# Altium project SDR_PMR.PrjPcb (part 5 of 12)

## Sheet Headphone_Amplifier.SchDoc
size A4; DocumentNumber: 8; SheetNumber: 12; SheetTotal: 18
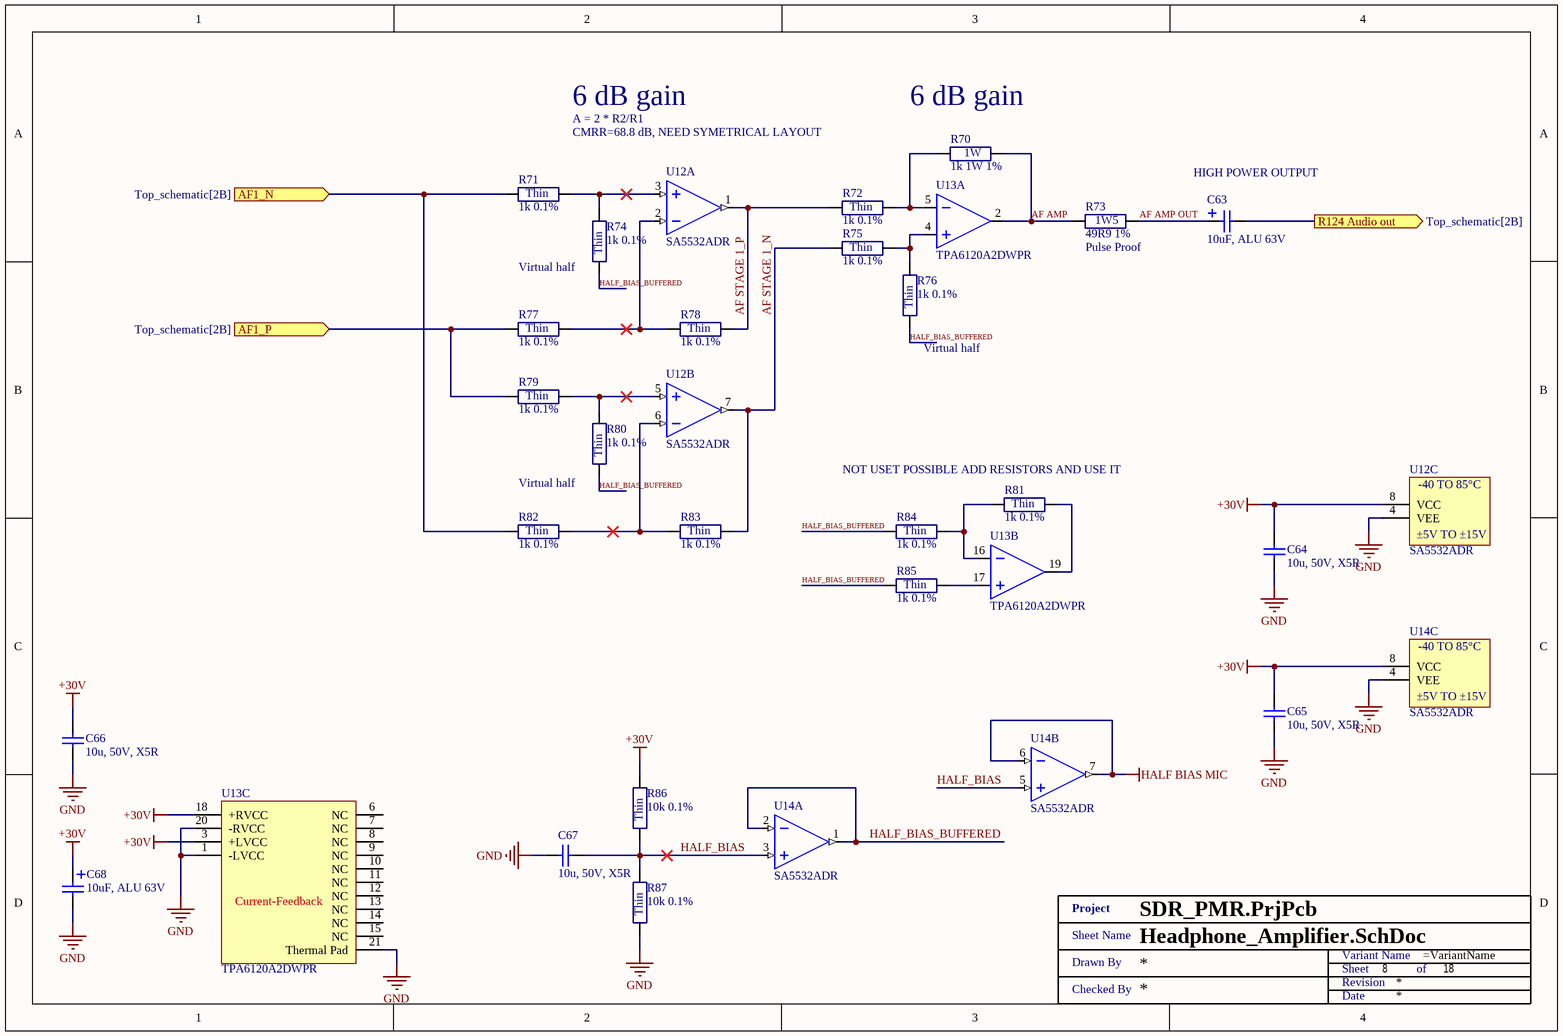
[diagram p4: Headphone_Amplifier.SchDoc]

### Parts
(Parts that share a designator on the sheet are numbered #1, #2 ... from top to bottom, then left to right.)
C63  10uF, ALU 63V  [WCAP-ATLI_5x11x2]
C64  10u, 50V, X5R  [SMD1206]
C65  10u, 50V, X5R  [SMD1206]
C66  10u, 50V, X5R  [SMD1206]
C67  10u, 50V, X5R  [SMD1206]
C68  10uF, ALU 63V  [WCAP-ATLI_5x11x2]
R70  1k 1W 1%  [SMD 2512 Resistor]
R71  1k 0.1%  [SMD0402 - R]
R72  1k 0.1%  [SMD0402 - R]
R73  49R9 1%  Info: Pulse Proof  [SMD 2512 Resistor]
R74  1k 0.1%  [SMD0402 - R]
R75  1k 0.1%  [SMD0402 - R]
R76  1k 0.1%  [SMD0402 - R]
R77  1k 0.1%  [SMD0402 - R]
R78  1k 0.1%  [SMD0402 - R]
R79  1k 0.1%  [SMD0402 - R]
R80  1k 0.1%  [SMD0402 - R]
R81  1k 0.1%  [SMD0402 - R]
R82  1k 0.1%  [SMD0402 - R]
R83  1k 0.1%  [SMD0402 - R]
R84  1k 0.1%  [SMD0402 - R]
R85  1k 0.1%  [SMD0402 - R]
R86  10k 0.1%  [SMD0402 - R]
R87  10k 0.1%  [SMD0402 - R]
U12  SA5532ADR  [SOIC08]  (parts A,B,C of 3)
U13  TPA6120A2DWPR  [SOIC20 - PowerPAD]  (parts A,B,C of 3)
U14  SA5532ADR  [SOIC08]  (parts A,B,C of 3)
XX?#5  Title 1  (value not drawn)  (graphical)

### Ports
AF1_N (in, see Top_schematic[2B]), AF1_P (in, see Top_schematic[2B]), R124 Audio out (out, see Top_schematic[2B])

### Nets
+30V: C64.2 C65.2 C66.2 C68.1 R86.2 U12.8(VCC) U13.3(+LVCC) U13.18(+RVCC) U14.8(VCC)
GND: C64.1 C65.1 C66.1 C67.2 C68.2 R87.1 U12.4(VEE) U13.1(-LVCC) U13.20(-RVCC) U13.21(Thermal_Pad) U14.4(VEE)
HALF BIAS MIC: U14.6(-IN_B) U14.7(OUT_B)
AF AMP: R70.2(GND) R73.1 U13.2(OUT1)
AF AMP OUT: C63.1 R73.2(GND)
AF STAGE 1_N: R75.1 R83.2 U12.7(OUT_B)
AF STAGE 1_P: R72.1 R78.2 U12.1(OUT_A)
HALF_BIAS: C67.1 R86.1 R87.2 U14.3(+IN_A) U14.5(+IN_B)
HALF_BIAS_BUFFERED: R74.1 R76.1 R80.1 R84.1 R85.1 U14.1(OUT_A) U14.2(-IN_A)
NetC63_2: C63.2 ; port R124 Audio out
NetR70_1: R70.1 R72.2 U13.5(IN1-)
NetR71_1: R71.1 R82.1 ; port AF1_N
NetR71_2: R71.2 R74.2 U12.3(+IN_A)
NetR75_2: R75.2 R76.2 U13.4(IN1+)
NetR77_1: R77.1 R79.1 ; port AF1_P
NetR77_2: R77.2 R78.1 U12.2(-IN_A)
NetR79_2: R79.2 R80.2 U12.5(+IN_B)
NetR81_1: R81.1 R84.2 U13.16(IN2-)
NetR81_2: R81.2 U13.19(OUT2)
NetR82_2: R82.2 R83.1 U12.6(-IN_B)
NetR85_2: R85.2 U13.17(IN2+)

Not connected (* = marked no-connect by the designer): U13 6(NC) 7(NC) 8(NC) 9(NC) 10(NC) 11(NC) 12(NC) 13(NC) 14(NC) 15(NC)

### Notes on the sheet
- 6 dB gain
- (near R70) 6 dB gain
- A = 2 * R2/R1
- CMRR=68.8 dB, NEED SYMETRICAL LAYOUT
- (near C63) HIGH POWER OUTPUT
- (near R74) Virtual half
- (near R76) Virtual half
- (near R80) Virtual half
- (near R81) NOT USET POSSIBLE ADD RESISTORS AND USE IT
- (in symbol CRCW251249R9FKEGHP) 1W5
- (in symbol SA5532ADR, part C) -40 TO 85°C; ±5V TO ±15V
- (in symbol TC0225B1001TCC) Thin
- (in symbol TC0225B1002TCC) Thin
- (in symbol Title 1) Project; Sheet Name; Variant Name; Drawn By; Sheet; of; Revision; Checked By; Date
- (in symbol TPA6120A2DWPR, part C) Current-Feedback

### Library data of the parts
C63 C68 = 860080772001: WURTH ELEKTRONIK - 860080772001 - CAP, ALU ELEC, 10UF, 63V, RADIAL; Ripple Current: 135mA @ 100kHz; Capacitance: 10u; Manufacturer: WURTH ELEKTRONIK; Manufacturer Part Number: 860080772001; RoHS: YES; Stock 1: 553; Pricing 1: 1=0.0957, 3=0.091, 5=0.0863, 10=0.0825, 20=0.0786, 50=0.0692, 250=0.0647, 500=0.0564 (GBP); ComponentLink1URL: http://www.farnell.com/datasheets/1879798.pdf; ComponentLink1Description: http://www.farnell.com/datasheets/1879798.pdf; Voltage Rating: 63V; Stock 3: 2136; Pricing 3: 1=0.62, 50=0.335, 100=0.289, 250=0.259, 500=0.235, 1500=0.202, 7500=0.182, 15000=0.178 (GBP); ComponentLink2URL: http://www.farnell.com/datasheets/2065186.pdf; ComponentLink2Description: http://www.farnell.com/datasheets/2065186.pdf; Supplier 1: Mouser; Supplier Part Number 1: 710-860080772001; Supplier 2: Farnell; Supplier Part Number 2: 2465955; Supplier 3: Digi-Key; Supplier Part Number 3: 732-9121-1-ND
C64-C67 = UMK316BBJ106KL-T: CAP CER 10UF 50V X5R 1206; Manufacturer: Taiyo Yuden; Tolerance: 10%; Supplier 1: Mouser; Supplier Part Number 1: 963-UMK316BBJ106KL-T; Manufacturer Part Number: UMK316BBJ106KL-T; RoHS: Yes; Category: Ceramic Capacitors; Stock 1: 207945; Pricing 1: 1=0,42000, 10=0,18000, 100=0,12800, 500=0,11000, 1000=0,09700, 2000=0,08000 (USD); Mount: Surface Mount; Case/Package: 1206; Min Operating Temperature: -55°C; Max Operating Temperature: 85°C; Packaging: Tape and Reel; Capacitance: 10u; Voltage Rating: 50V; Length: 0.126inch; Width: 0.063inch; Thickness: 0.071inch; Lead Free: Lead Free; ComponentLink1URL: http://ds.yuden.co.jp/TYCOMPAS/ut/detail.do?productNo=UMK316BBJ106KL-T&fileName=UMK316BBJ106KL-T_SS&mode=specSheetDownload&src-supplier=Digi-Key; ComponentLink1Description: http://ds.yuden.co.jp/TYCOMPAS/ut/detail.do?productNo=UMK316BBJ106KL-T&fileName=UMK316BBJ106KL-T_SS&mode=specSheetDownload&src-supplier=Digi-Key; ComponentLink2URL: https://www.yuden.co.jp/productdata/catalog/mlcc01_e.pdf?src-supplier=Digi-Key; ComponentLink2Description: https://www.yuden.co.jp/productdata/catalog/mlcc01_e.pdf?src-supplier=Digi-Key; ComponentLink3URL: http://www.yuden.co.jp/productdata/catalog/en/mlcc_all_e.pdf?src-supplier=Digi-Key; ComponentLink3Description: http://www.yuden.co.jp/productdata/catalog/en/mlcc_all_e.pdf?src-supplier=Digi-Key; Supplier 2: Digi-Key; Supplier Part Number 2: 587-5960-1-ND; Supplier 3: Avnet; Supplier Part Number 3: UMK316BBJ106KL-T
R70 = AC2512FK-071KL: Res Thick Film 2512 1K Ohm 1% 1W ±100ppm/C Pad SMD T/R Automotive AEC-Q200; Manufacturer: Yageo Group; Temperature Coefficient: 100ppm/°C; Working Voltage: 200V; Supplier: Mouser; Supplier Part Number: 603-AC2512FK-071KL; Manufacturer Part Number: AC2512FK-071KL; RoHS: Compliant; Category: Chip SMD Resistors; Stock: 1301; Pricing: 1=0,32, 10=0,176, 50=0,154, 100=0,119, 1000=0,093, 10000=0,078 (USD); Case/Package: 2512; Case Code (Imperial): 2512; Case Code (Metric): 6432; China RoHS: Non-Compliant; Composition: Thick Film; Features: Automotive AEC-Q200, Moisture Resistant; Height: 550µm; Length: 6.35mm; Lifecycle Status: Production; Max Operating Temperature: 155°C; Max Power Dissipation: 1W; Min Operating Temperature: -55°C; Mounting Technology: Surface Mount; Number of Terminals: 2; Number of Terminations: 2; Power Rating: 1W; Ratings: AEC-Q200; REACH SVHC: Yes; Resistance: 1k; Schedule B: 8533210045, 8533210045|8533210045|8533210045|8533210045|8533210045; Tolerance: 1%; Width: 3.1mm; ComponentLink1URL: https://datasheet.octopart.com:443/AC2512FK-071KL-Yageo-datasheet-182189377.pdf?src-supplier=IHS; ComponentLink1Description: https://datasheet.octopart.com:443/AC2512FK-071KL-Yageo-datasheet-182189377.pdf?src-supplier=IHS; ComponentLink2URL: https://datasheet.octopart.com:443/AC2512FK-071KL-Yageo-Group-datasheet-188689268.pdf?src-supplier=LCSC; ComponentLink2Description: https://datasheet.octopart.com:443/AC2512FK-071KL-Yageo-Group-datasheet-188689268.pdf?src-supplier=LCSC; ComponentLink3URL: https://datasheet.octopart.com:443/AC2512FK-071KL-Yageo-datasheet-178509465.pdf?src-supplier=Farnell; ComponentLink3Description: https://datasheet.octopart.com:443/AC2512FK-071KL-Yageo-datasheet-178509465.pdf?src-supplier=Farnell; ComponentLink4URL: https://datasheet.octopart.com:443/AC2512FK-071KL-Yageo-datasheet-166720450.pdf?src-supplier=Future+Electronics; ComponentLink4Description: https://datasheet.octopart.com:443/AC2512FK-071KL-Yageo-datasheet-166720450.pdf?src-supplier=Future+Electronics; ComponentLink5URL: https://datasheet.octopart.com:443/AC2512FK-071KL-Yageo-datasheet-151884373.pdf?src-supplier=Future+Electronics; ComponentLink5Description: https://datasheet.octopart.com:443/AC2512FK-071KL-Yageo-datasheet-151884373.pdf?src-supplier=Future+Electronics; ComponentLink6URL: https://datasheet.octopart.com:443/AC2512FK-071KL-Yageo-datasheet-137699919.pdf?src-supplier=Future+Electronics; ComponentLink6Description: https://datasheet.octopart.com:443/AC2512FK-071KL-Yageo-datasheet-137699919.pdf?src-supplier=Future+Electronics; ComponentLink7URL: https://datasheet.octopart.com:443/AC2512FK-071KL-Yageo-datasheet-83209224.pdf?src-supplier=Future+Electronics; ComponentLink7Description: https://datasheet.octopart.com:443/AC2512FK-071KL-Yageo-datasheet-83209224.pdf?src-supplier=Future+Electronics; ComponentLink8URL: https://datasheet.octopart.com:443/AC2512FK-071KL-Yageo-datasheet-62139191.pdf?src-supplier=Future+Electronics; ComponentLink8Description: https://datasheet.octopart.com:443/AC2512FK-071KL-Yageo-datasheet-62139191.pdf?src-supplier=Future+Electronics; ComponentLink9URL: https://datasheet.octopart.com:443/AC2512FK-071KL-Yageo-Group-datasheet-164768995.pdf?src-supplier=ODG+(Origin+Data+Global); ComponentLink9Description: https://datasheet.octopart.com:443/AC2512FK-071KL-Yageo-Group-datasheet-164768995.pdf?src-supplier=ODG+(Origin+Data+Global); ComponentLink10URL: https://datasheet.octopart.com/AC2512FK-071KL-Yageo-datasheet-12512238.pdf; ComponentLink10Description: https://datasheet.octopart.com/AC2512FK-071KL-Yageo-datasheet-12512238.pdf; ComponentLink11URL: http://sigma.octopart.com:80/conflict_mineral_statement/Yageo-company-3.pdf?src-supplier=Compliance+Statements; ComponentLink11Description: http://sigma.octopart.com:80/conflict_mineral_statement/Yageo-company-3.pdf?src-supplier=Compliance+Statements; ComponentLink12URL: http://sigma.octopart.com:80/rohs_statement/Yageo-company-2.pdf?src-supplier=Compliance+Statements; ComponentLink12Description: http://sigma.octopart.com:80/rohs_statement/Yageo-company-2.pdf?src-supplier=Compliance+Statements
R71 R72 R74-R85 = TC0225B1001TCC: 62.5mW Thin Film Resistor 25V ±25ppm/℃ ±0.1% 1kΩ 0402 Chip Resistor - Surface Mount ROHS; Manufacturer: Uniroyal; Working Voltage: 50V; Supplier 1: LCSC; Supplier Part Number 1: C2989674; Manufacturer Part Number: TC0225B1001TCC; Category: Chip SMD Resistors; Stock 1: 12060; Pricing 1: 20=0.036, 200=0.031, 600=0.0283, 2000=0.0267, 10000=0.0252, 20000=0.0245 (USD); Case/Package: 0402; Composition: Thin Film; Export Control Classification Number (ECCN) Code: EAR99; Height: 300µm; Harmonized Tariff Schedule (HTS) Code: 8533.21.00.30; Length: 1mm; Lifecycle Status: Production; Max Operating Temperature: 155°C; Min Operating Temperature: -55°C; Mounting Technology: Surface Mount; Number of Terminals: 2; Power Rating: 62.5mW; Resistance: 1k; Tolerance: 0.1%; Width: 500µm; ComponentLink1URL: https://datasheet.octopart.com:443/TC0225B1001TCC-Uniroyal-datasheet-194228365.pdf?src-supplier=LCSC; ComponentLink1Description: https://datasheet.octopart.com:443/TC0225B1001TCC-Uniroyal-datasheet-194228365.pdf?src-supplier=LCSC
R73 = CRCW251249R9FKEGHP: Res Thick Film 2512 49.9 Ohm 1% 1.5W ±100ppm/°C Molded SMD SMD Blister T/R; Manufacturer: Vishay Dale; Voltage Rating: 500V; Supplier 1: Mouser; Supplier Part Number 1: 71-CRCW251249R9FKEGH; Manufacturer Part Number: CRCW251249R9FKEGHP; RoHS: Yes; Category: Chip SMD Resistors; Stock 1: 291; Pricing 1: 1=0.73, 10=0.46, 50=0.46, 100=0.338, 1000=0.203, 10000=0.182 (USD); Case/Package: 2512; Weight: 0.001482oz; Case Code (Metric): 6432; Case Code (Imperial): 2512; Contact Plating: Tin; Min Operating Temperature: -55°C; Max Operating Temperature: 155°C; Packaging: Tape and Reel; Resistance: 49R9; Tolerance: 1%; Power Rating: 1.5W; Package Quantity: 2000; Number of Terminations: 2; Max Power Dissipation: 1.5W; Temperature Coefficient: 100ppm/°C; Features: Automotive AEC-Q200; Series: CRCW-HP; Length: 6.3mm; Width: 3.2mm; Height: 0.6mm; Ratings: AEC-Q200; Radiation Hardening: No; Lead Free: Lead Free; RoHS Compliant: Yes; ComponentLink1URL: https://datasheet.ciiva.com/2483/crcwhpe3-2483893.pdf?src-supplier=Digi-Key; ComponentLink1Description: https://datasheet.ciiva.com/2483/crcwhpe3-2483893.pdf?src-supplier=Digi-Key; ComponentLink2URL: https://datasheet.ciiva.com/2483/crcwhpe3-2483894.pdf?src-supplier=Digi-Key; ComponentLink2Description: https://datasheet.ciiva.com/2483/crcwhpe3-2483894.pdf?src-supplier=Digi-Key; ComponentLink3URL: https://datasheet.ciiva.com/2483/crcwhpe3-2483895.pdf?src-supplier=Digi-Key; ComponentLink3Description: https://datasheet.ciiva.com/2483/crcwhpe3-2483895.pdf?src-supplier=Digi-Key; ComponentLink4URL: https://datasheet.ciiva.com/5548/crcwhpe3-46056-5548183.pdf?src-supplier=Mouser; ComponentLink4Description: https://datasheet.ciiva.com/5548/crcwhpe3-46056-5548183.pdf?src-supplier=Mouser; Supplier 2: Digi-Key; Supplier Part Number 2: 541-49.9RCT-ND; Supplier 3: Arrow Electronics; Supplier Part Number 3: CRCW251249R9FKEGHP
R86 R87 = TC0225B1002TCC: Fixed Resistor, Thin Film, 0.0625W, 10000ohm, 50V, 0.1% +/-Tol, Surface Mount, 0402; Manufacturer: Uniroyal; Power Rating: 62.5mW; Supplier 1: LCSC; Supplier Part Number 1: C2989267; Manufacturer Part Number: TC0225B1002TCC; Category: Chip SMD Resistors; Stock 1: 10200; Pricing 1: 20=0.0396, 200=0.0352, 600=0.0327, 2000=0.0312, 10000=0.0299, 20000=0.0292 (USD); Case/Package: 0402; Composition: Thin Film; Export Control Classification Number (ECCN) Code: EAR99; Height: 300µm; Harmonized Tariff Schedule (HTS) Code: 8533.21.00.30; Length: 1mm; Lifecycle Status: Production; Max Operating Temperature: 155°C; Min Operating Temperature: -55°C; Mounting Technology: Surface Mount; Number of Terminals: 2; Resistance: 10k; Tolerance: 0.1%; Width: 500µm; Working Voltage: 50V; ComponentLink1URL: https://datasheet.octopart.com:443/TC0225B1002TCC-Uniroyal-datasheet-194228365.pdf?src-supplier=LCSC; ComponentLink1Description: https://datasheet.octopart.com:443/TC0225B1002TCC-Uniroyal-datasheet-194228365.pdf?src-supplier=LCSC
U12 U14 = SA5532ADR: ROHS3Compliant EAR99 SA5532 Cut Tape (CT) op amp buffer circuit 4.9mm 200nA 4mV 10000kHz; Manufacturer: Texas Instruments; Manufacturer Lifecycle Status: ACTIVE; Bandwidth: 10MHz; Common Mode Rejection Ratio: 70dB; Input Bias Current: 800nA; Max Dual Supply Voltage: 15V; Min Dual Supply Voltage: 5V; Nominal Supply Current: 16mA; Number of Channels: 2; Operating Supply Current: 8mA; Output Current: 38mA; Slew Rate: 9V/µs; Voltage Gain: 100dB; Manufacturer Part Number: SA5532ADR; RoHS: Compliant; Category: Amplifiers - Op Amps, Buffer, Instrumentation; Pricing 1: 1=0.58, 10=0.405, 50=0.363, 100=0.316, 1000=0.269, 10000=0.249 (USD); Case/Package: SOIC; Contact Plating: Gold; Gain Bandwidth Product: 10MHz; Height: 1.75mm; Input Offset Voltage (Vos): 4mV; Lead Free: Lead Free; Length: 4.9mm; Lifecycle Status: Production; Max I/O Voltage: 4mV; Max Operating Temperature: 85°C; Max Supply Voltage: 15V; Min Operating Temperature: -40°C; Nominal Gain Bandwidth Product: 10MHz; Number of Circuits: 2; Number of Elements: 2; Pins: 8; Output Current per Channel: 38mA; Radiation Hardening: No; Schedule B: 8542330000, 8542330000|8542330000|8542330000|8542330000|8542330000; Thickness: 1.58mm; Width: 3.91mm; ComponentLink1URL: https://datasheet.octopart.com:443/SA5532ADR-Texas-Instruments-datasheet-41216652.pdf?src-supplier=Texas+Instruments; ComponentLink1Description: https://datasheet.octopart.com:443/SA5532ADR-Texas-Instruments-datasheet-41216652.pdf?src-supplier=Texas+Instruments; ComponentLink2URL: https://octopart.com:443/opatz8j6/c1?t=BMvzKz7-sj-S1-Dsr8DdYqdwvlAJ1p8EkRXKuSmmWP-6byp-ij1qjOCBNe3kiZ3VXcZV_2y_9BNtRyS6u4HeRxplgPa6tIscd6ONAd2o7cOSCVgEvHKbcW5aVa9TzAtJzxrLl3EL3jMW4_3-9hBLoKePFC9U6uwTHoowvK-6ULYqA_cqsAnRVsDlRoqy1hQQmhpGhdTdZRO1RoDh0uRfck1XzJnG1HhE6rhdpTgDPcT597XV8iSYx_kN_H9eCK8qNRRFOX_BOxK1gYE8mPq_MY-XmnDjgshG-IxPARb-O9C2qjigCjmd4F8ZlZv55EvB5eotoi6nSKHqH6N_VFx0jIAU0z77gYIUEADzPI9nLSljJ6AxAnNjNOtkzVrGTAn7ZMs&src-supplier=Texas+Instruments; ComponentLink2Description: https://octopart.com:443/opatz8j6/c1?t=BMvzKz7-sj-S1-Dsr8DdYqdwvlAJ1p8EkRXKuSmmWP-6byp-ij1qjOCBNe3kiZ3VXcZV_2y_9BNtRyS6u4HeRxplgPa6tIscd6ONAd2o7cOSCVgEvHKbcW5aVa9TzAtJzxrLl3EL3jMW4_3-9hBLoKePFC9U6uwTHoowvK-6ULYqA_cqsAnRVsDlRoqy1hQQmhpGhdTdZRO1RoDh0uRfck1XzJnG1HhE6rhdpTgDPcT597XV8iSYx_kN_H9eCK8qNRRFOX_BOxK1gYE8mPq_MY-XmnDjgshG-IxPARb-O9C2qjigCjmd4F8ZlZv55EvB5eotoi6nSKHqH6N_VFx0jIAU0z77gYIUEADzPI9nLSljJ6AxAnNjNOtkzVrGTAn7ZMs&src-supplier=Texas+Instruments; ComponentLink3URL: https://datasheet.octopart.com:443/SA5532ADR-Texas-Instruments-datasheet-10255165.pdf?src-supplier=Texas+Instruments; ComponentLink3Description: https://datasheet.octopart.com:443/SA5532ADR-Texas-Instruments-datasheet-10255165.pdf?src-supplier=Texas+Instruments; ComponentLink4URL: https://sigma.octopart.com:443/49249642/technical_drawing/Texas-Instruments-SA5532ADR.pdf?src-supplier=Texas+Instruments; ComponentLink4Description: https://sigma.octopart.com:443/49249642/technical_drawing/Texas-Instruments-SA5532ADR.pdf?src-supplier=Texas+Instruments; ComponentLink5URL: https://datasheet.octopart.com:443/SA5532ADR-Texas-Instruments-datasheet-150397.pdf?src-supplier=Texas+Instruments; ComponentLink5Description: https://datasheet.octopart.com:443/SA5532ADR-Texas-Instruments-datasheet-150397.pdf?src-supplier=Texas+Instruments; ComponentLink6URL: https://datasheet.octopart.com:443/SA5532ADR-Texas-Instruments-datasheet-37101722.pdf?src-supplier=Newark; ComponentLink6Description: https://datasheet.octopart.com:443/SA5532ADR-Texas-Instruments-datasheet-37101722.pdf?src-supplier=Newark; ComponentLink7URL: https://datasheet.octopart.com:443/SA5532ADR-Texas-Instruments-datasheet-83579903.pdf?src-supplier=Newark; ComponentLink7Description: https://datasheet.octopart.com:443/SA5532ADR-Texas-Instruments-datasheet-83579903.pdf?src-supplier=Newark; ComponentLink8URL: https://datasheet.octopart.com:443/SA5532ADR-Texas-Instruments-datasheet-27616440.pdf?src-supplier=Newark; ComponentLink8Description: https://datasheet.octopart.com:443/SA5532ADR-Texas-Instruments-datasheet-27616440.pdf?src-supplier=Newark; ComponentLink9URL: https://datasheet.octopart.com:443/SA5532ADR-Texas-Instruments-datasheet-21222538.pdf?src-supplier=Newark; ComponentLink9Description: https://datasheet.octopart.com:443/SA5532ADR-Texas-Instruments-datasheet-21222538.pdf?src-supplier=Newark; ComponentLink10URL: https://datasheet.octopart.com:443/SA5532ADR-Texas-Instruments-datasheet-165345935.pdf?src-supplier=LCSC; ComponentLink10Description: https://datasheet.octopart.com:443/SA5532ADR-Texas-Instruments-datasheet-165345935.pdf?src-supplier=LCSC; ComponentLink11URL: https://datasheet.octopart.com:443/SA5532ADR-Texas-Instruments-datasheet-159115543.pdf?src-supplier=LCSC; ComponentLink11Description: https://datasheet.octopart.com:443/SA5532ADR-Texas-Instruments-datasheet-159115543.pdf?src-supplier=LCSC; ComponentLink12URL: https://datasheet.octopart.com:443/SA5532ADR-Texas-Instruments-datasheet-164415849.pdf?src-supplier=SHENGYU+ELECTRONICS; ComponentLink12Description: https://datasheet.octopart.com:443/SA5532ADR-Texas-Instruments-datasheet-164415849.pdf?src-supplier=SHENGYU+ELECTRONICS; ComponentLink13URL: https://datasheet.octopart.com:443/SA5532ADR-Texas-Instruments-datasheet-14137414.pdf?src-supplier=iiiC; ComponentLink13Description: https://datasheet.octopart.com:443/SA5532ADR-Texas-Instruments-datasheet-14137414.pdf?src-supplier=iiiC; ComponentLink14URL: https://datasheet.octopart.com:443/SA5532ADR-Texas-Instruments-datasheet-43639.pdf?src-supplier=DigiKey; ComponentLink14Description: https://datasheet.octopart.com:443/SA5532ADR-Texas-Instruments-datasheet-43639.pdf?src-supplier=DigiKey; ComponentLink15URL: https://datasheet.octopart.com:443/SA5532ADR-Texas-Instruments-datasheet-114123.pdf?src-supplier=Sierra+IC; ComponentLink15Description: https://datasheet.octopart.com:443/SA5532ADR-Texas-Instruments-datasheet-114123.pdf?src-supplier=Sierra+IC; ComponentLink16URL: http://sigma.octopart.com:80/reach_statement/Texas-Instruments-company-64.pdf?src-supplier=Compliance+Statements; ComponentLink16Description: http://sigma.octopart.com:80/reach_statement/Texas-Instruments-company-64.pdf?src-supplier=Compliance+Statements; ComponentLink17URL: http://sigma.octopart.com:80/conflict_mineral_statement/Texas-Instruments-company-63.pdf?src-supplier=Compliance+Statements; ComponentLink17Description: http://sigma.octopart.com:80/conflict_mineral_statement/Texas-Instruments-company-63.pdf?src-supplier=Compliance+Statements; Supplier 1: Mouser; Supplier Part Number 1: 595-SA5532ADR; Supplier 2: LCSC; Supplier Part Number 2: C83716; Supplier 3: TME; Supplier Part Number 3: SA5532ADR
U13 = TPA6120A2DWPR: Audio Amp Headphone 2-CH Stereo Class-AB 20-Pin HSOP EP T/R / IC AMP AUDIO .08W HIFI 20SOPWR; Manufacturer: Texas Instruments; Manufacturer Lifecycle Status: ACTIVE; Common Mode Rejection Ratio: 100dB; Dual Supply Voltage: 12V; Input Offset Voltage (Vos): 5mV; Load Impedance: 32Ω; Max Dual Supply Voltage: 15V; Max Output Power: 80mW; Max Power Dissipation: 2.8W; Max Supply Voltage: 30V; Min Dual Supply Voltage: 5V; Min Supply Voltage: 10V; Nominal Supply Current: 26mA; Number of Channels: 2; Power Supply Rejection Ratio (PSRR): 75dB; Supply Type: Dual, Single; Supplier: Mouser; Supplier Part Number: 595-TPA6120A2DWPR; Manufacturer Part Number: TPA6120A2DWPR; RoHS: Compliant; Category: Amplifiers - Audio; Stock: 1848; Pricing: 1=4,56, 10=3,45, 50=3,2, 100=2,92, 1000=2,65, 10000=2,43 (USD); Case/Package: SOIC; Height: 2.65mm; Lead Free: Lead Free; Length: 12.82mm; Lifecycle Status: Production; Max Operating Temperature: 85°C; Min Operating Temperature: -40°C; Pins: 20; Power Dissipation: 2.8W; Radiation Hardening: No; REACH SVHC: No; Schedule B: 8542330000, 8542330000|8542330000, 8542330000|8542330000|8542330000, 8542330000|8542330000|8542330000|8542330000; Thickness: 2.55mm; Weight: 506.605978mg; Width: 7.52mm; ComponentLink1URL: https://datasheet.octopart.com:443/TPA6120A2DWPR-Texas-Instruments-datasheet-37140791.pdf?src-supplier=Texas+Instruments; ComponentLink1Description: https://datasheet.octopart.com:443/TPA6120A2DWPR-Texas-Instruments-datasheet-37140791.pdf?src-supplier=Texas+Instruments; ComponentLink2URL: https://octopart.com:443/opatz8j6/c1?t=JqOv4FVc-FpbxUN-PVaM8y6v8Enq4zEw70tizFTkgl_PjJGHv1lLsNRLfmKOXhJiC_DlvHsTbXAKCjLAKgShaGuH5LosEx9gedHA4Yt6jAtpS8VuyZtF57jgpYUzLSRvKF-Digekr3pY7G2E8wRRlh4bVV2Yoy0nxG5ZjwkitUF21iaVSCkXGFi7bWTM24WFVH4cukM9TXCkA04Xx6HuLf5M6i2aBhuTL9-e2n6UfxNuQlgPpParlL4UVVPYsGLpxm8oT5V7Z-x48qduKpWIg14bBbWdxehzVymNOTy92yxW74cxgIr4dNNoZYQDh8D5YNE4I66XG_TTCf3wPQ2sTfxH7M9-4JyTxdSAbpTzTC_EcUfYchcvwDxf6bP56BWHFIicUG4i&src-supplier=Texas+Instruments; ComponentLink2Description: https://octopart.com:443/opatz8j6/c1?t=JqOv4FVc-FpbxUN-PVaM8y6v8Enq4zEw70tizFTkgl_PjJGHv1lLsNRLfmKOXhJiC_DlvHsTbXAKCjLAKgShaGuH5LosEx9gedHA4Yt6jAtpS8VuyZtF57jgpYUzLSRvKF-Digekr3pY7G2E8wRRlh4bVV2Yoy0nxG5ZjwkitUF21iaVSCkXGFi7bWTM24WFVH4cukM9TXCkA04Xx6HuLf5M6i2aBhuTL9-e2n6UfxNuQlgPpParlL4UVVPYsGLpxm8oT5V7Z-x48qduKpWIg14bBbWdxehzVymNOTy92yxW74cxgIr4dNNoZYQDh8D5YNE4I66XG_TTCf3wPQ2sTfxH7M9-4JyTxdSAbpTzTC_EcUfYchcvwDxf6bP56BWHFIicUG4i&src-supplier=Texas+Instruments; ComponentLink3URL: https://datasheet.octopart.com:443/TPA6120A2DWPR-Texas-Instruments-datasheet-27842578.pdf?src-supplier=Texas+Instruments; ComponentLink3Description: https://datasheet.octopart.com:443/TPA6120A2DWPR-Texas-Instruments-datasheet-27842578.pdf?src-supplier=Texas+Instruments; ComponentLink4URL: https://datasheet.octopart.com:443/TPA6120A2DWPR-Texas-Instruments-datasheet-152758.pdf?src-supplier=Texas+Instruments; ComponentLink4Description: https://datasheet.octopart.com:443/TPA6120A2DWPR-Texas-Instruments-datasheet-152758.pdf?src-supplier=Texas+Instruments; ComponentLink5URL: https://sigma.octopart.com:443/49252430/technical_drawing/Texas-Instruments-TPA6120A2DWPR.pdf?src-supplier=Texas+Instruments; ComponentLink5Description: https://sigma.octopart.com:443/49252430/technical_drawing/Texas-Instruments-TPA6120A2DWPR.pdf?src-supplier=Texas+Instruments; ComponentLink6URL: https://datasheet.octopart.com:443/TPA6120A2DWPR-Texas-Instruments-datasheet-10282523.pdf?src-supplier=Arrow+Electronics; ComponentLink6Description: https://datasheet.octopart.com:443/TPA6120A2DWPR-Texas-Instruments-datasheet-10282523.pdf?src-supplier=Arrow+Electronics; ComponentLink7URL: https://datasheet.octopart.com:443/TPA6120A2DWPR-Texas-Instruments-datasheet-164392906.pdf?src-supplier=SHENGYU+ELECTRONICS; ComponentLink7Description: https://datasheet.octopart.com:443/TPA6120A2DWPR-Texas-Instruments-datasheet-164392906.pdf?src-supplier=SHENGYU+ELECTRONICS; ComponentLink8URL: https://datasheet.octopart.com:443/TPA6120A2DWPR-Texas-Instruments-datasheet-62116065.pdf?src-supplier=Newark; ComponentLink8Description: https://datasheet.octopart.com:443/TPA6120A2DWPR-Texas-Instruments-datasheet-62116065.pdf?src-supplier=Newark; ComponentLink9URL: https://datasheet.octopart.com:443/TPA6120A2DWPR-Texas-Instruments-datasheet-31978455.pdf?src-supplier=Newark; ComponentLink9Description: https://datasheet.octopart.com:443/TPA6120A2DWPR-Texas-Instruments-datasheet-31978455.pdf?src-supplier=Newark; ComponentLink10URL: https://datasheet.octopart.com:443/TPA6120A2DWPR-Texas-Instruments-datasheet-17728655.pdf?src-supplier=Newark; ComponentLink10Description: https://datasheet.octopart.com:443/TPA6120A2DWPR-Texas-Instruments-datasheet-17728655.pdf?src-supplier=Newark; ComponentLink11URL: https://datasheet.octopart.com:443/TPA6120A2DWPR-Texas-Instruments-datasheet-137316104.pdf?src-supplier=Future+Electronics; ComponentLink11Description: https://datasheet.octopart.com:443/TPA6120A2DWPR-Texas-Instruments-datasheet-137316104.pdf?src-supplier=Future+Electronics; ComponentLink12URL: http://sigma.octopart.com:80/reach_statement/Texas-Instruments-company-64.pdf?src-supplier=Compliance+Statements; ComponentLink12Description: http://sigma.octopart.com:80/reach_statement/Texas-Instruments-company-64.pdf?src-supplier=Compliance+Statements; ComponentLink13URL: http://sigma.octopart.com:80/conflict_mineral_statement/Texas-Instruments-company-63.pdf?src-supplier=Compliance+Statements; ComponentLink13Description: http://sigma.octopart.com:80/conflict_mineral_statement/Texas-Instruments-company-63.pdf?src-supplier=Compliance+Statements; Supplier 1: Mouser; Supplier Part Number 1: 595-TPA6120A2DWPR

## Sheet Audio_codec.SchDoc
size A4; SheetNumber: 11; SheetTotal: 18
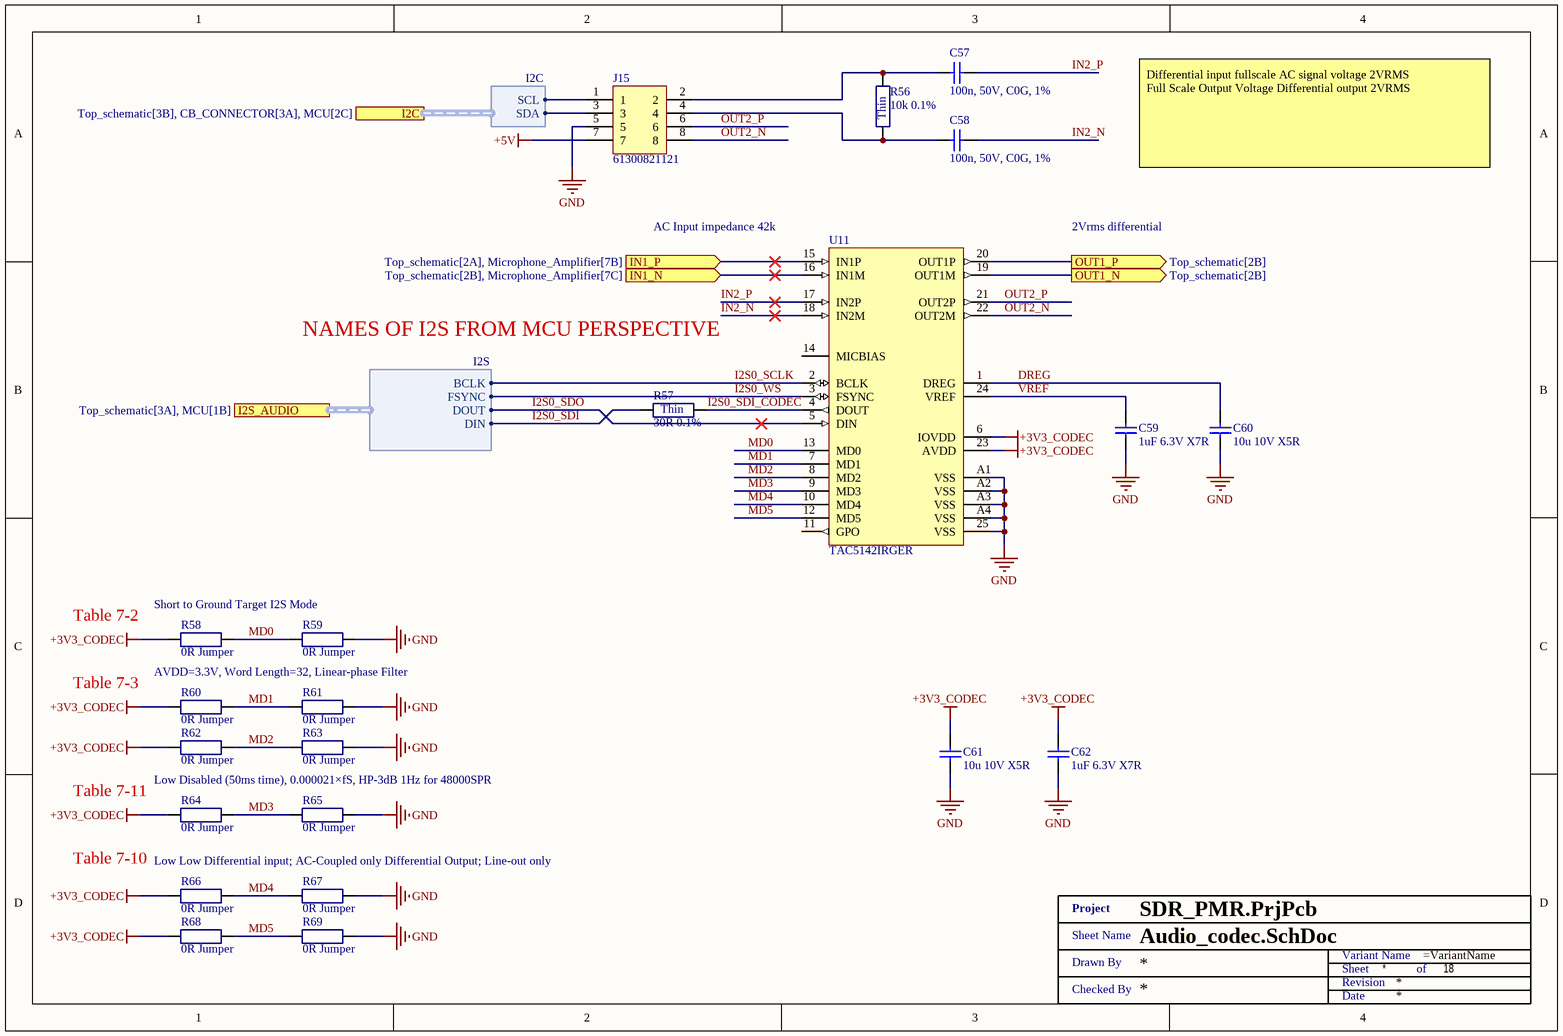
[diagram p5: Audio_codec.SchDoc]

### Parts
(Parts that share a designator on the sheet are numbered #1, #2 ... from top to bottom, then left to right.)
C57  100n, 50V, C0G, 1%  [SMD1206]
C58  100n, 50V, C0G, 1%  [SMD1206]
C59  1uF 6.3V X7R  [SMD0402]
C60  10u 10V X5R  [SMD0603]
C61  10u 10V X5R  [SMD0603]
C62  1uF 6.3V X7R  [SMD0402]
J15  61300821121  [61300821121]
R56  10k 0.1%  [SMD0402 - R]
R57  30R 0.1%  [SMD0402 - R]
R58  0R Jumper  [SMD0402 - R]
R59  0R Jumper  [SMD0402 - R]
R60  0R Jumper  [SMD0402 - R]
R61  0R Jumper  [SMD0402 - R]
R62  0R Jumper  [SMD0402 - R]
R63  0R Jumper  [SMD0402 - R]
R64  0R Jumper  [SMD0402 - R]
R65  0R Jumper  [SMD0402 - R]
R66  0R Jumper  [SMD0402 - R]
R67  0R Jumper  [SMD0402 - R]
R68  0R Jumper  [SMD0402 - R]
R69  0R Jumper  [SMD0402 - R]
U11  TAC5142IRGER  [QFN50P400X400X75_HS-29M]
XX?#6  Title 1  (value not drawn)  (graphical)

### Ports
I2C (harness I2C, see Top_schematic[3B], CB_CONNECTOR[3A], MCU[2C]), I2S_AUDIO (harness I2S, see Top_schematic[3A], MCU[1B]), IN1_N (in, see Top_schematic[2B], Microphone_Amplifier[7C]), IN1_P (in, see Top_schematic[2A], Microphone_Amplifier[7B]), OUT1_N (out, see Top_schematic[2B]), OUT1_P (out, see Top_schematic[2B])

### Harnesses
I2S: BCLK, FSYNC, DOUT, DIN
I2C: SCL, SDA

### Nets
+3V3_CODEC: C61.2 C62.2 R58.1 R60.1 R62.1 R64.1 R66.1 R68.1 U11.6(IOVDD) U11.23(AVDD)
+5V: J15.7
GND: C59.1 C60.1 C61.1 C62.1 J15.5 R59.2 R61.2 R63.2 R65.2 R67.2 R69.2 U11.25(VSS) U11.A1(VSS) U11.A2(VSS) U11.A3(VSS) U11.A4(VSS)
DREG: C60.2 U11.1(DREG)
I2C_SCL: J15.1 ; port I2C.SCL
I2C_SDA: J15.3 ; port I2C.SDA
I2S0_SCLK: U11.2(BCLK) ; port I2S_AUDIO.BCLK
I2S0_SDI: R57.1 ; port I2S_AUDIO.DIN
I2S0_SDI_CODEC: R57.2 U11.4(DOUT)
I2S0_SDO: U11.5(DIN) ; port I2S_AUDIO.DOUT
I2S0_WS: U11.3(FSYNC) ; port I2S_AUDIO.FSYNC
IN2_N: C58.2 U11.18(IN2M)
IN2_P: C57.2 U11.17(IN2P)
MD0: R58.2 R59.1 U11.13(MD0)
MD1: R60.2 R61.1 U11.7(MD1)
MD2: R62.2 R63.1 U11.8(MD2)
MD3: R64.2 R65.1 U11.9(MD3)
MD4: R66.2 R67.1 U11.10(MD4)
MD5: R68.2 R69.1 U11.12(MD5)
OUT2_N: J15.8 U11.22(OUT2M)
OUT2_P: J15.6 U11.21(OUT2P)
VREF: C59.2 U11.24(VREF)
NetC57_1: C57.1 J15.2 R56.2
NetC58_1: C58.1 J15.4 R56.1
NetD1_3: U11.15(IN1P) ; port IN1_P
NetD2_3: U11.16(IN1M) ; port IN1_N
NetR71_1: U11.19(OUT1M) ; port OUT1_N
NetR77_1: U11.20(OUT1P) ; port OUT1_P

Not connected (* = marked no-connect by the designer): U11 11(GPO) 14(MICBIAS)

### Notes on the sheet
- Differential input fullscale AC signal voltage 2VRMS
  Full Scale Output Voltage Differential output 2VRMS
- (near U11) AC Input impedance 42k
- 2Vrms differential
- NAMES OF I2S FROM MCU PERSPECTIVE
- (near R58) Table 7-2
- Short to Ground Target I2S Mode
- Table 7-3
- AVDD=3.3V, Word Length=32, Linear-phase Filter
- Low Disabled (50ms time), 0.000021×fS, HP-3dB 1Hz for 48000SPR
- Table 7-11
- Table 7-10
- Low Low Differential input; AC-Coupled only Differential Output; Line-out only
- (in symbol TC0225B300JTCC) Thin
- (in symbol TC0225B1002TCC) Thin
- (in symbol Title 1) Project; Sheet Name; Variant Name; Drawn By; Sheet; of; Revision; Checked By; Date

### Library data of the parts
C57 C58 = GCM31C5C1H104FA16L: CAP CER 0.1UF 50V C0G/NP0 1206 1%; Manufacturer: Murata; Supplier 1: Mouser; Supplier Part Number 1: 81-GCM31C5C1H104FA16; Manufacturer Part Number: GCM31C5C1H104FA16L; RoHS: No; Stock 1: 9381; Pricing 1: 1=1,24000, 10=0,98200, 25=0,90100, 100=0,73700, 250=0,59000, 500=0,55700 (USD); Supplier 2: Digi-Key; Supplier Part Number 2: 490-GCM31C5C1H104FA16LCT-ND; Supplier 3: Future Electronics; Supplier Part Number 3: GCM31C5C1H104FA16L-CUTT; Capacitance: 100n
C59 C62 = TCC0402X7R105K6R3AT: Capacitor: MLCC; SMD; 0402; 1µF; 6.3V; ±10%; X7R; CCTC; Capacitance: 1u; Supplier 1: LCSC; Supplier Part Number 1: C5448871; Manufacturer: CCTC; Manufacturer Part Number: TCC0402X7R105K6R3AT; Category: Ceramic Capacitors; Stock 1: 242350; Pricing 1: 50=0.0089, 500=0.0072, 1500=0.0063, 10000=0.0058, 20000=0.0053, 50000=0.005 (USD); ComponentLink1URL: https://datasheet.octopart.com:443/TCC0402X7R105K6R3AT-CCTC-datasheet-194166649.pdf?src-supplier=LCSC; ComponentLink1Description: https://datasheet.octopart.com:443/TCC0402X7R105K6R3AT-CCTC-datasheet-194166649.pdf?src-supplier=LCSC; ComponentLink2URL: https://datasheet.octopart.com:443/TCC0402X7R105K6R3AT-CCTC-datasheet-192317456.pdf?src-supplier=HQonline; ComponentLink2Description: https://datasheet.octopart.com:443/TCC0402X7R105K6R3AT-CCTC-datasheet-192317456.pdf?src-supplier=HQonline
C60 C61 = TCC0603X5R106K100CT: Multilayer Ceramic Capacitor (MLCC) 10uF ±10% 10V X5R 0603 SMD, CCTC TCC Series; Capacitance: 10u; Supplier 1: LCSC; Supplier Part Number 1: C380314
J15 = 61300821121: CONN HEADER DUAL 8 POS 2.54; Manufacturer: Wurth Electronics; Number of Positions: 8; Gender: Male; Connector Type: Male Pin; Pitch: 0.1inch; Supplier 1: Mouser; Supplier Part Number 1: 710-61300821121; Manufacturer Part Number: 61300821121; RoHS: Yes; Category: Connectors; Stock 1: 1828; Pricing 1: 1=0,66000, 10=0,55700, 50=0,38700, 100=0,35200, 1000=0,32000, 10000=0,32000 (USD); Mount: Through Hole; Contact Plating: Gold; Contact Material: Copper; Color: Black; Number of Rows: 2; Packaging: Bulk; Termination: Solder; Number of Contacts: 8; Row Spacing: 0.1inch; Contact Mating Length: 0.236inch; REACH SVHC: Unknown; Lead Free: Lead Free; ComponentLink1URL: https://datasheet.ciiva.com/28505/1442180-28505510.pdf?src-supplier=Element14; ComponentLink1Description: https://datasheet.ciiva.com/28505/1442180-28505510.pdf?src-supplier=Element14; Supplier 2: Farnell; Supplier Part Number 2: 2356133; Supplier 3: Digi-Key; Supplier Part Number 3: 732-5296-ND
R56 = TC0225B1002TCC: as R86 on sheet Headphone_Amplifier; Supplier 1: LCSC; Supplier Part Number 1: C2989267; Manufacturer Part Number: TC0225B1002TCC; Category: Chip SMD Resistors; Stock 1: 10200; Pricing 1: 20=0.0396, 200=0.0352, 600=0.0327, 2000=0.0312, 10000=0.0299, 20000=0.0292 (USD); Case/Package: 0402; Composition: Thin Film; Export Control Classification Number (ECCN) Code: EAR99; Height: 300µm; Harmonized Tariff Schedule (HTS) Code: 8533.21.00.30; Length: 1mm; Lifecycle Status: Production; Max Operating Temperature: 155°C; Min Operating Temperature: -55°C; Mounting Technology: Surface Mount; Number of Terminals: 2; Resistance: 10k; Tolerance: 0.1%; Width: 500µm; Working Voltage: 50V; ComponentLink1URL: https://datasheet.octopart.com:443/TC0225B1002TCC-Uniroyal-datasheet-194228365.pdf?src-supplier=LCSC; ComponentLink1Description: https://datasheet.octopart.com:443/TC0225B1002TCC-Uniroyal-datasheet-194228365.pdf?src-supplier=LCSC
R57 = TC0225B300JTCC: Resistor: thin film; SMD; 0402; 30Ω; 62.5mW; ±0.1%; TC25; 25V; -55÷155°C; Manufacturer: Uniroyal; Supplier 1: LCSC; Supplier Part Number 1: C50670254; Manufacturer Part Number: TC0225B300JTCC; Category: Uncategorized; Stock 1: 4950; Pricing 1: 50=0.0203, 500=0.0161, 1500=0.0137, 10000=0.0123, 20000=0.0111, 50000=0.0104 (USD); ComponentLink1URL: https://datasheet.octopart.com:443/TC0225B300JTCC-Uniroyal-datasheet-194228366.pdf?src-supplier=LCSC; ComponentLink1Description: https://datasheet.octopart.com:443/TC0225B300JTCC-Uniroyal-datasheet-194228366.pdf?src-supplier=LCSC; Resistance: 30R
R58-R69 = HQ02WAF0000TCE: Resistor: thick film / jumper; SMD; 0402; 0Ω; 100mW; max 50V; -55÷155°C; UNI-ROYAL; Manufacturer: Uniroyal; Supplier 1: LCSC; Supplier Part Number 1: C2791314; Manufacturer Part Number: HQ02WAF0000TCE; Category: Uncategorized; Stock 1: 5900; Pricing 1: 100=0.0059, 1000=0.0051, 3000=0.0047, 10000=0.0045, 50000=0.0043 (USD); ComponentLink1URL: https://datasheet.octopart.com:443/HQ02WAF0000TCE-Uniroyal-datasheet-194224146.pdf?src-supplier=LCSC; ComponentLink1Description: https://datasheet.octopart.com:443/HQ02WAF0000TCE-Uniroyal-datasheet-194224146.pdf?src-supplier=LCSC; Resistance: 0R
U11 = TAC5142IRGER: Hardware-control stereo audio codec with 103dB dynamic range ADC and 110dB dynamic range DAC 24-VQFN -40 to 125; Manufacturer: Texas Instruments; Manufacturer Lifecycle Status: ACTIVE; Manufacturer Part Number: TAC5142IRGER; RoHS: Compliant; Category: Integrated Circuits (ICs); Stock 1: 2850; Pricing 1: 1=6.3, 10=4.51, 50=4.2, 100=3.7, 1000=2.65, 10000=2.55 (USD); Case/Package: VQFN; Height: 1mm; Length: 4mm; Lifecycle Status: Production; Pins: 24; Thickness: 880µm; Width: 4mm; ComponentLink1URL: https://octopart.com:443/opatz8j6/c1?t=YFSsGmLZcXWbdqrMCLw25IWqAw6k9gFxKaNNOU5wJ5U63vvZS52iNskDVgOi5J4xgN5KPzz--1Njgko23HC53B69eB64g8FSkhDhHzGcD5KrituH4jgy77dM-s58_KmxCpoQqfF3HD_-yEwyGTjuiWHTsoXT1jS6pbZW4ctduK_uBwCqcvg92laEZnnqk2ukOUJzEU_frpK-cKVjuCpImP142kfOHwqxOwJpnik2TleQTesp86vGKR9pXa9aRFl2yx8nE5VZPK63oTyjnrLMYY5u2TyYQKW-RDyaHeJHA47OtZuaK3EW5H8MrGTYhH6hOo8E_w7nwzwe9whMRXrdGLOrV0dO_iTP6E8jlXzXlsxlojXu9U5dgL4fqUxWv1fEEkGW8wt7&src-supplier=Texas+Instruments; ComponentLink1Description: https://octopart.com:443/opatz8j6/c1?t=YFSsGmLZcXWbdqrMCLw25IWqAw6k9gFxKaNNOU5wJ5U63vvZS52iNskDVgOi5J4xgN5KPzz--1Njgko23HC53B69eB64g8FSkhDhHzGcD5KrituH4jgy77dM-s58_KmxCpoQqfF3HD_-yEwyGTjuiWHTsoXT1jS6pbZW4ctduK_uBwCqcvg92laEZnnqk2ukOUJzEU_frpK-cKVjuCpImP142kfOHwqxOwJpnik2TleQTesp86vGKR9pXa9aRFl2yx8nE5VZPK63oTyjnrLMYY5u2TyYQKW-RDyaHeJHA47OtZuaK3EW5H8MrGTYhH6hOo8E_w7nwzwe9whMRXrdGLOrV0dO_iTP6E8jlXzXlsxlojXu9U5dgL4fqUxWv1fEEkGW8wt7&src-supplier=Texas+Instruments; ComponentLink2URL: http://sigma.octopart.com:80/reach_statement/Texas-Instruments-company-64.pdf?src-supplier=Compliance+Statements; ComponentLink2Description: http://sigma.octopart.com:80/reach_statement/Texas-Instruments-company-64.pdf?src-supplier=Compliance+Statements; ComponentLink3URL: http://sigma.octopart.com:80/conflict_mineral_statement/Texas-Instruments-company-63.pdf?src-supplier=Compliance+Statements; ComponentLink3Description: http://sigma.octopart.com:80/conflict_mineral_statement/Texas-Instruments-company-63.pdf?src-supplier=Compliance+Statements; Supplier 1: Mouser; Supplier Part Number 1: 595-TAC5142IRGER; Supplier 2: LCSC; Supplier Part Number 2: C43656746